# Altium project power.PrjPCB
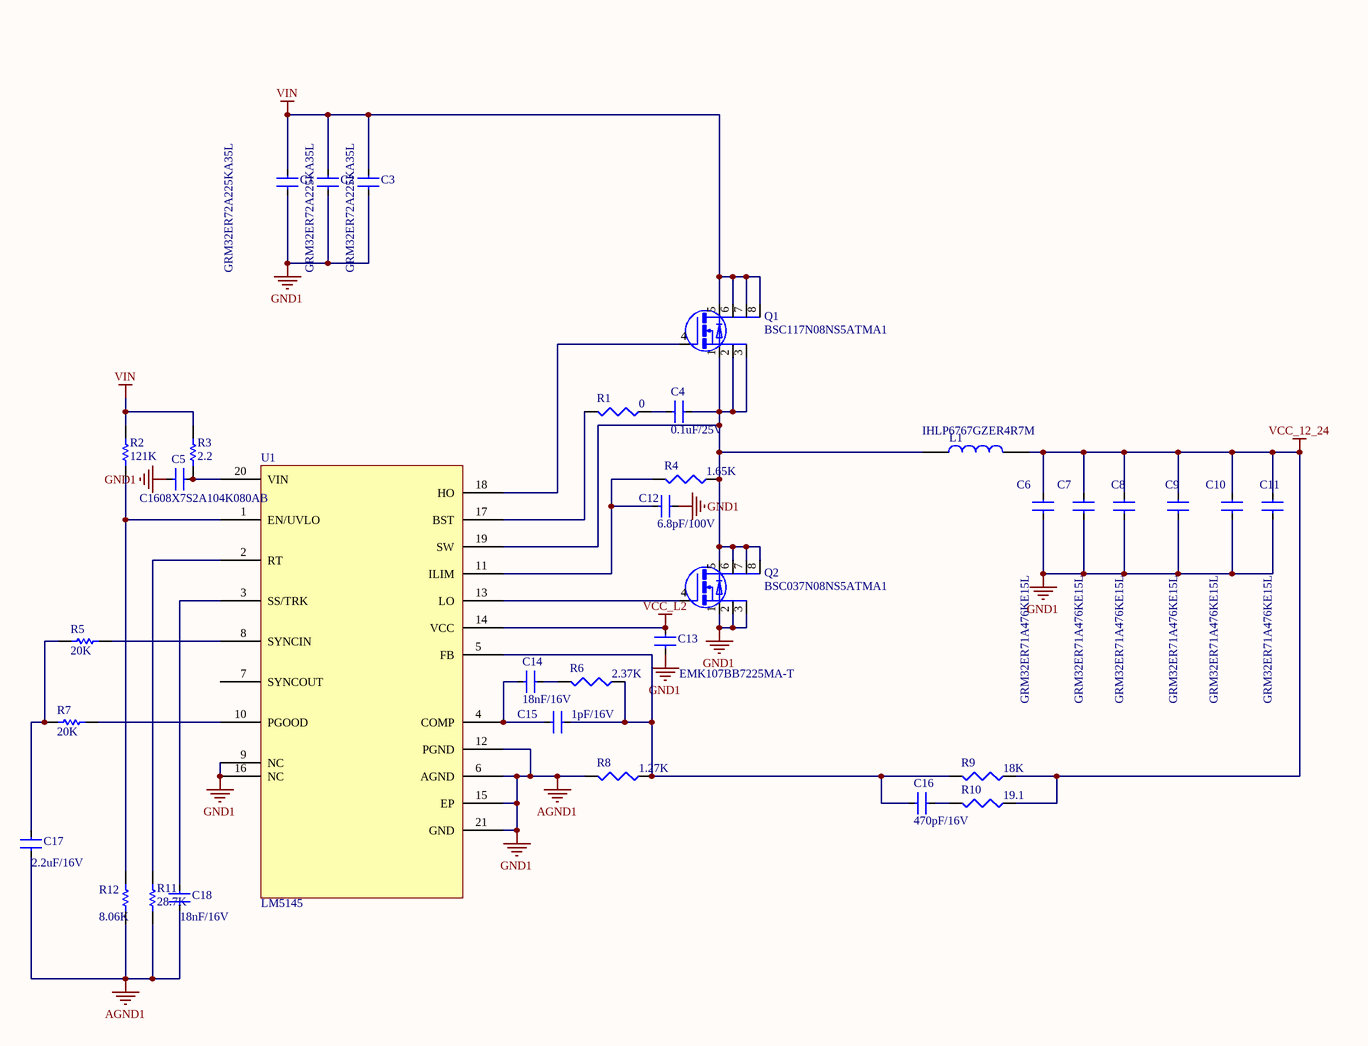
[diagram p0: airmachine.SchDoc]
2 sheets, 67 parts. Net scope: global (net labels, ports and power ports of the same name join across sheets).
Board file: PCB2.PcbDoc
Sheets:
  airmachine.SchDoc
  usb.SchDoc

## Sheet airmachine.SchDoc
size A3

### Parts
C1  GRM32ER72A225KA35L  [1210C]
C2  GRM32ER72A225KA35L  [1210C]
C3  GRM32ER72A225KA35L  [1210C]
C4  0.1uF/25V  [0603C]
C5  C1608X7S2A104K080AB  [0603C]
C6  GRM32ER71A476KE15L  [1210C]
C7  GRM32ER71A476KE15L  [1210C]
C8  GRM32ER71A476KE15L  [1210C]
C9  GRM32ER71A476KE15L  [1210C]
C10  GRM32ER71A476KE15L  [1210C]
C11  GRM32ER71A476KE15L  [1210C]
C12  6.8pF/100V  [0603C]
C13  EMK107BB7225MA-T  [0603C]
C14  18nF/16V  [0603C]
C15  1pF/16V  [0603C]
C16  470pF/16V  [0603C]
C17  2.2uF/16V  [0603C]
C18  18nF/16V  [0603C]
L1  IHLP6767GZER4R7M  [IHLP-6767GZ]
Q1  BSC117N08NS5ATMA1  [PowerPAK SO-8]
Q2  BSC037N08NS5ATMA1  [PowerPAK SO-8]
R1  0  [0603R]
R2  121K  [0805R]
R3  2.2  [0603R]
R4  1.65K  [0603R]
R5  20K  [0603R]
R6  2.37K  [0603R]
R7  20K  [0603R]
R8  1.27K  [0603R]
R9  18K  [0603R]
R10  19.1  [0603R]
R11  28.7K  [0603R]
R12  8.06K  [0603R]
U1  LM5145  [QFN050P600-8N]

### Nets
AGND1: C1.2 C2.2 C3.2 C5.1 C6.2 C7.2 C8.2 C9.2 C10.2 C11.2 C12.1 C13.2 C17.2 C18.2 Q2.1(S) Q2.2(S) Q2.3(S) R8.2 R11.1 R12.1 U1.6(AGND) U1.9(NC) U1.12(PGND) U1.15(EP) U1.16(NC) U1.21(GND)  [also labelled GND1]
VCC_12_24: C6.1 C7.1 C8.1 C9.1 C10.1 C11.1 L1.2 R9.1 R10.1
VCC_L2: C13.1 U1.14(VCC)
VIN: C1.1 C2.1 C3.1 Q1.5(D) Q1.6(D) Q1.7(D) Q1.8(D) R2.2 R3.1
NetC4_1: C4.1 R1.1
NetC4_2: C4.2 L1.1 Q1.1(S) Q1.2(S) Q1.3(S) Q2.5(D) Q2.6(D) Q2.7(D) Q2.8(D) R4.1 U1.19(SW)
NetC5_2: C5.2 R3.2 U1.20(VIN)
NetC12_2: C12.2 R4.2 U1.11(ILIM)
NetC14_1: C14.1 C15.1 U1.4(COMP)
NetC14_2: C14.2 R6.2
NetC15_2: C15.2 C16.1 R6.1 R8.1 R9.2 U1.5(FB)
NetC16_2: C16.2 R10.2
NetC17_1: C17.1 R5.2 R7.2
NetC18_1: C18.1 U1.3(SS/TRK)
NetQ1_4: Q1.4(G) U1.18(HO)
NetQ2_4: Q2.4(G) U1.13(LO)
NetR1_2: R1.2 U1.17(BST)
NetR2_1: R2.1 R12.2 U1.1(EN/UVLO)
NetR5_1: R5.1 U1.8(SYNCIN)
NetR7_1: R7.1 U1.10(PGOOD)
NetR11_2: R11.2 U1.2(RT)

Not connected (* = marked no-connect by the designer): U1 7(SYNCOUT)

### Library data of the parts
C1-C18 = 0.01UF: CCX85-103
L1 = INDUCTOR
Q1 Q2 = Si4004DY
R1 R4 R6 R8-R10 = Res3: Resistor; Published: 8-Jun-2000; LatestRevisionDate: 29-May-2009; LatestRevisionNote: IPC-7351 Footprint Added.; PackageReference: J1-0603; Publisher: Altium Limited; PackageDescription: Chip Resistor
R2 R3 R5 R7 R11 R12 = Res Semi: Semiconductor Resistor; Value: 1K; Published: 8-Jun-2000; LatestRevisionDate: 17-Jul-2002; LatestRevisionNote: Re-released for DXP Platform.; PackageReference: AXIAL-0.5; Publisher: Altium Limited

## Sheet usb.SchDoc
size A3
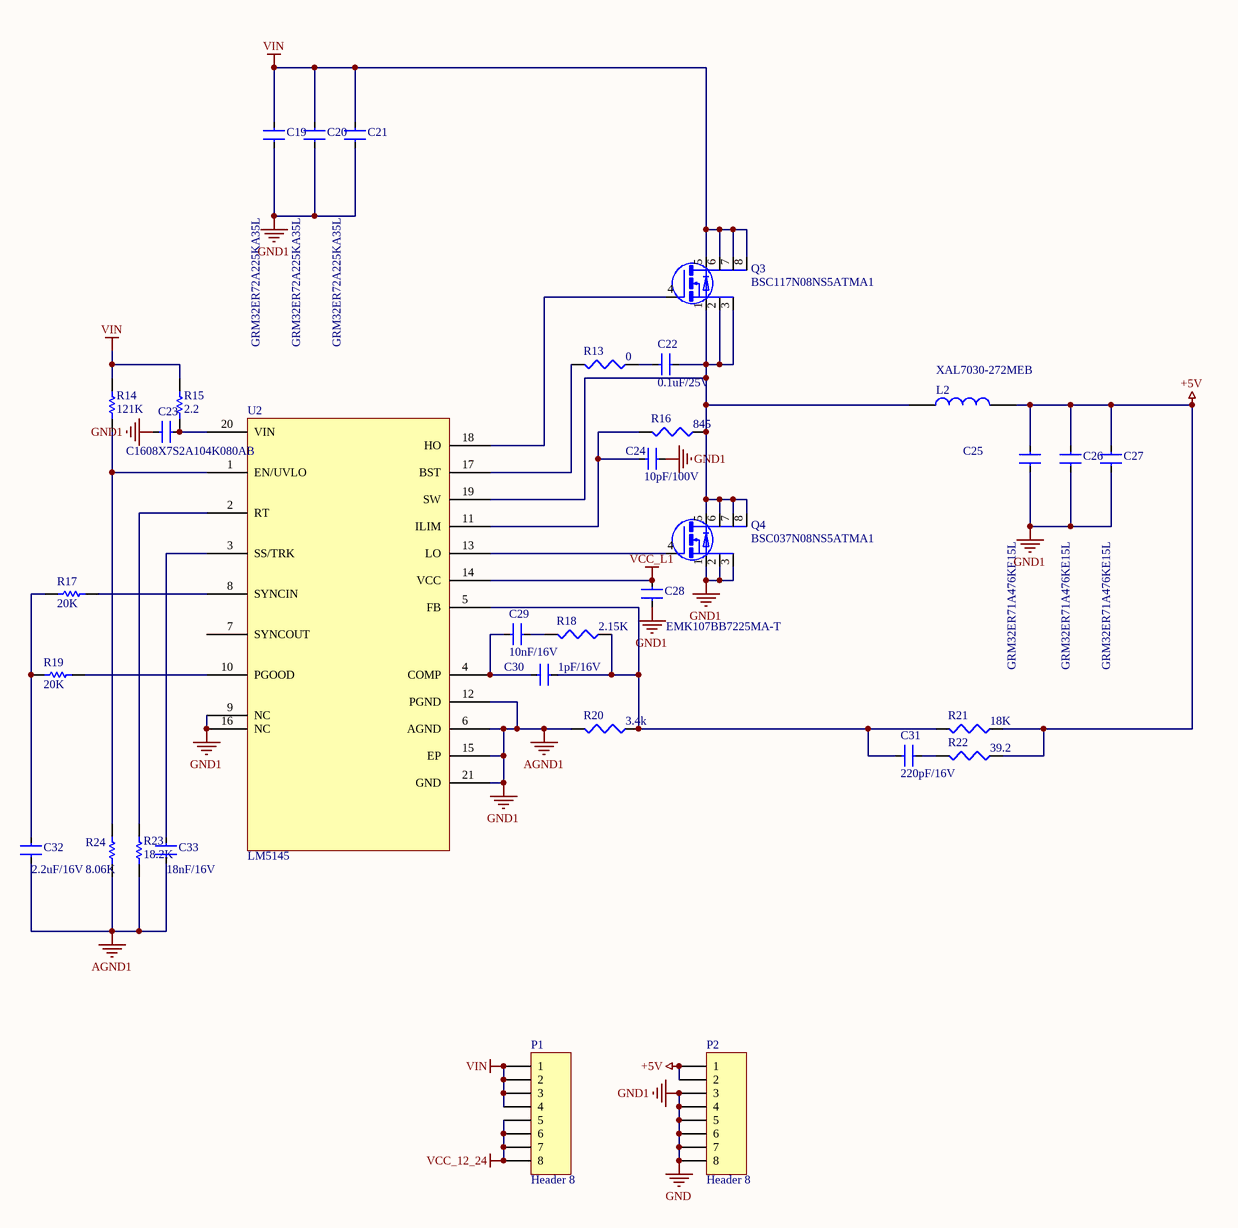
[diagram p1: usb.SchDoc]

### Parts
C19  GRM32ER72A225KA35L  [1210C]
C20  GRM32ER72A225KA35L  [1210C]
C21  GRM32ER72A225KA35L  [1210C]
C22  0.1uF/25V  [0603C]
C23  C1608X7S2A104K080AB  [0603C]
C24  10pF/100V  [0603C]
C25  GRM32ER71A476KE15L  [1210C]
C26  GRM32ER71A476KE15L  [1210C]
C27  GRM32ER71A476KE15L  [1210C]
C28  EMK107BB7225MA-T  [0603C]
C29  10nF/16V  [0603C]
C30  1pF/16V  [0603C]
C31  220pF/16V  [0603C]
C32  2.2uF/16V  [0603C]
C33  18nF/16V  [0603C]
L2  XAL7030-272MEB  [XAL7030]
P1  Header 8  [CH3.96-8P]
P2  Header 8  [CH3.96-8P]
Q3  BSC117N08NS5ATMA1  [PowerPAK SO-8]
Q4  BSC037N08NS5ATMA1  [PowerPAK SO-8]
R13  0  [0603R]
R14  121K  [0805R]
R15  2.2  [0603R]
R16  845  [0603R]
R17  20K  [0603R]
R18  2.15K  [0603R]
R19  20K  [0603R]
R20  3.4k  [0603R]
R21  18K  [0603R]
R22  39.2  [0603R]
R23  18.2K  [0603R]
R24  8.06K  [0603R]
U2  LM5145  [QFN050P600-8N]

### Nets
+5V: C25.1 C26.1 C27.1 L2.2 P2.1 P2.2 R21.1 R22.1
AGND1: C19.2 C20.2 C21.2 C23.1 C24.1 C25.2 C26.2 C27.2 C28.2 C32.2 C33.2 P2.3 P2.4 P2.5 P2.6 P2.7 P2.8 Q4.1(S) Q4.2(S) Q4.3(S) R20.2 R23.1 R24.1 U2.6(AGND) U2.9(NC) U2.12(PGND) U2.15(EP) U2.16(NC) U2.21(GND)  [also labelled GND, GND1]
VCC_12_24: P1.5 P1.6 P1.7 P1.8
VCC_L1: C28.1 U2.14(VCC)
VIN: C19.1 C20.1 C21.1 P1.1 P1.2 P1.3 P1.4 Q3.5(D) Q3.6(D) Q3.7(D) Q3.8(D) R14.2 R15.1
NetC22_1: C22.1 R13.1
NetC22_2: C22.2 L2.1 Q3.1(S) Q3.2(S) Q3.3(S) Q4.5(D) Q4.6(D) Q4.7(D) Q4.8(D) R16.1 U2.19(SW)
NetC23_2: C23.2 R15.2 U2.20(VIN)
NetC24_2: C24.2 R16.2 U2.11(ILIM)
NetC29_1: C29.1 C30.1 U2.4(COMP)
NetC29_2: C29.2 R18.2
NetC30_2: C30.2 C31.1 R18.1 R20.1 R21.2 U2.5(FB)
NetC31_2: C31.2 R22.2
NetC32_1: C32.1 R17.2 R19.2
NetC33_1: C33.1 U2.3(SS/TRK)
NetQ3_4: Q3.4(G) U2.18(HO)
NetQ4_4: Q4.4(G) U2.13(LO)
NetR13_2: R13.2 U2.17(BST)
NetR14_1: R14.1 R24.2 U2.1(EN/UVLO)
NetR17_1: R17.1 U2.8(SYNCIN)
NetR19_1: R19.1 U2.10(PGOOD)
NetR23_2: R23.2 U2.2(RT)

Not connected (* = marked no-connect by the designer): U2 7(SYNCOUT)

### Library data of the parts
C19-C33 = 0.01UF: CCX85-103
L2 = INDUCTOR
P1 P2 = Header 8: Header, 8-Pin; LatestRevisionDate: 17-Jul-2002; LatestRevisionNote: Re-released for DXP Platform.; Publisher: Altium Limited
Q3 Q4 = Si4004DY
R13 R16 R18 R20-R22 = Res3: Resistor; Published: 8-Jun-2000; LatestRevisionDate: 29-May-2009; LatestRevisionNote: IPC-7351 Footprint Added.; PackageReference: J1-0603; Publisher: Altium Limited; PackageDescription: Chip Resistor
R14 R15 R17 R19 R23 R24 = Res Semi: Semiconductor Resistor; Value: 1K; Published: 8-Jun-2000; LatestRevisionDate: 17-Jul-2002; LatestRevisionNote: Re-released for DXP Platform.; PackageReference: AXIAL-0.5; Publisher: Altium Limited

## Nets that join several sheets
AGND1: airmachine (26 pins), usb (29 pins)
VCC_12_24: airmachine (9 pins), usb (P1.5 P1.6 P1.7 P1.8)
VIN: airmachine (9 pins), usb (13 pins)